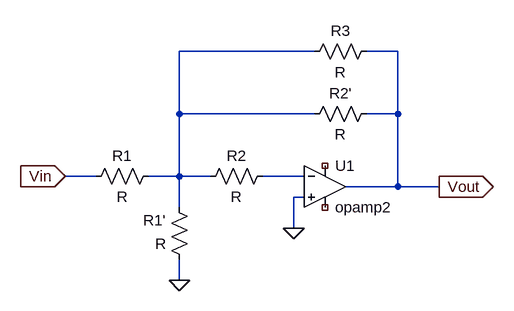
[diagram p0: schematic rauch_sim.asc]
rauch_sim.asc, the LTspice schematic file:
Version 4
SHEET 1 880 680
WIRE 432 -32 224 -32
WIRE 560 -32 512 -32
WIRE 224 64 224 -32
WIRE 432 64 224 64
WIRE 560 64 560 -32
WIRE 560 64 512 64
WIRE 96 160 48 160
WIRE 224 160 224 64
WIRE 224 160 176 160
WIRE 272 160 224 160
WIRE 416 160 352 160
WIRE 560 176 560 64
WIRE 560 176 480 176
WIRE 624 176 560 176
WIRE 416 192 400 192
WIRE 224 208 224 160
WIRE 400 240 400 192
WIRE 224 320 224 288
FLAG 224 320 0
FLAG 400 240 0
FLAG 48 160 Vin
IOPIN 48 160 In
FLAG 624 176 Vout
IOPIN 624 176 Out
SYMBOL res 192 144 R90
WINDOW 0 0 56 VBottom 2
WINDOW 3 32 56 VTop 2
SYMATTR InstName R1
SYMBOL res 240 304 R180
WINDOW 0 36 76 Left 2
WINDOW 3 36 40 Left 2
SYMATTR InstName R1'
SYMBOL res 256 176 R270
WINDOW 0 32 56 VTop 2
WINDOW 3 0 56 VBottom 2
SYMATTR InstName R2
SYMBOL Opamps\\opamp2 448 112 R0
SYMATTR InstName U1
SYMBOL res 528 48 R90
WINDOW 0 0 56 VBottom 2
WINDOW 3 32 56 VTop 2
SYMATTR InstName R2'
SYMBOL res 528 -48 R90
WINDOW 0 0 56 VBottom 2
WINDOW 3 32 56 VTop 2
SYMATTR InstName R3

The netlist it stands for:
* rauch_sim.asc
R1 N001 Vin R
R1' 0 N001 R
R2 N001 N002 R
XU1 0 N002 NC_01 NC_02 Vout opamp2  ; pins In+ In- V+ V- OUT
R2' Vout N001 R
R3 Vout N001 R
.backanno
.end